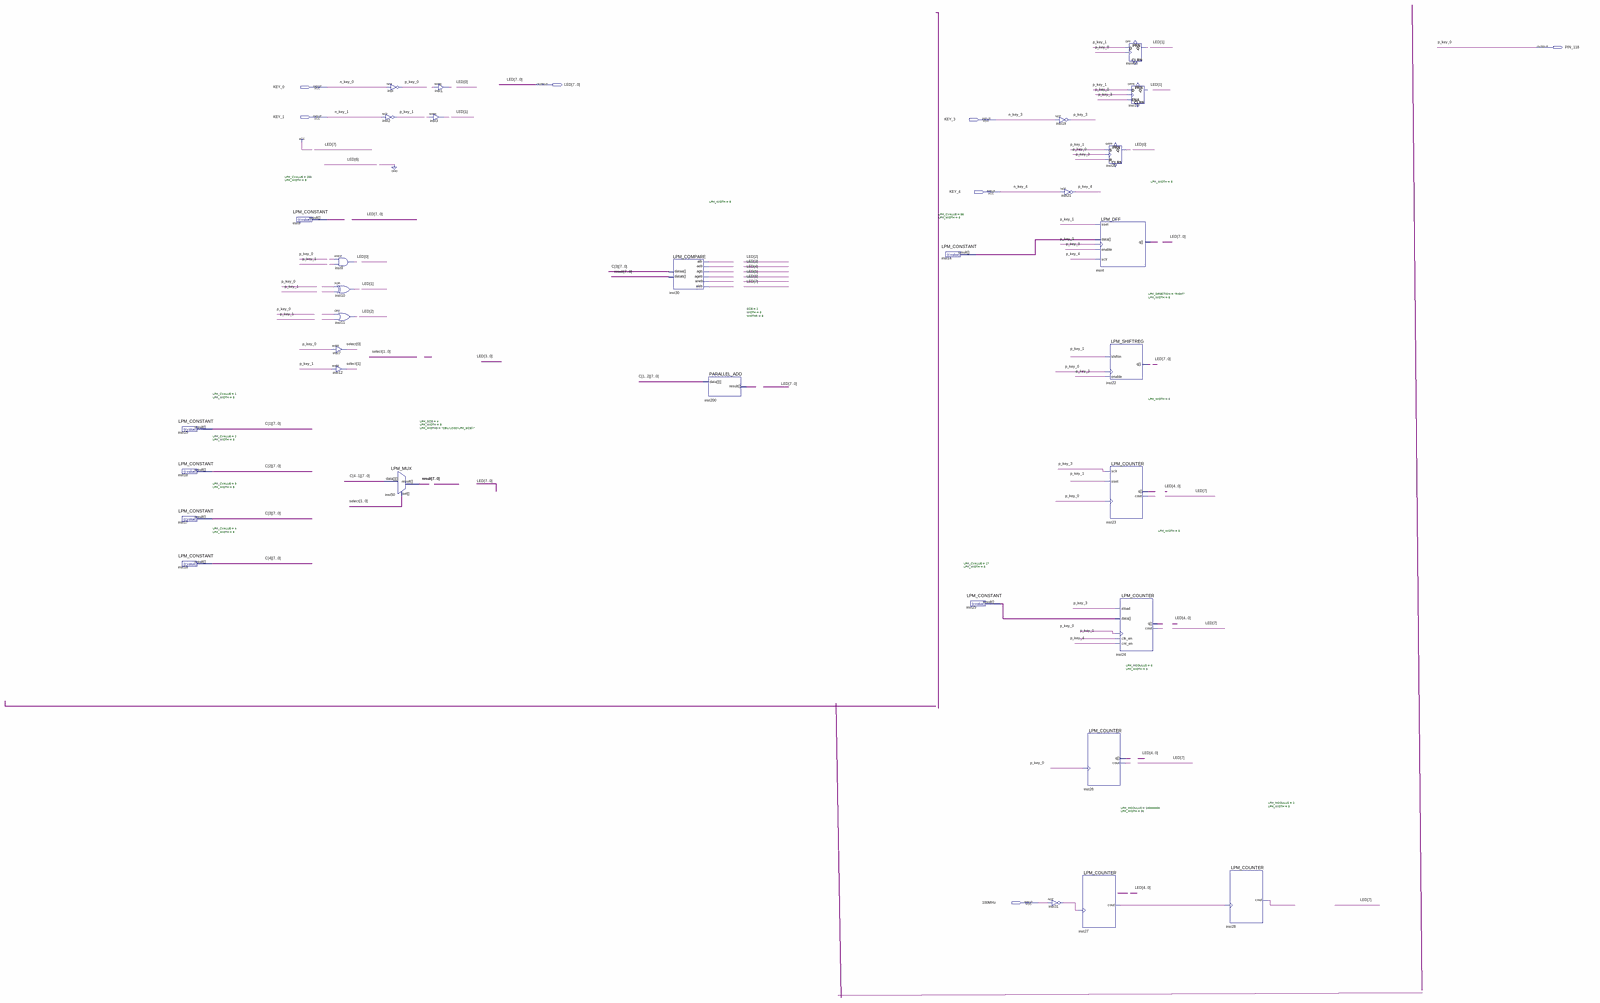
[diagram p0: schematic sheet, whole]
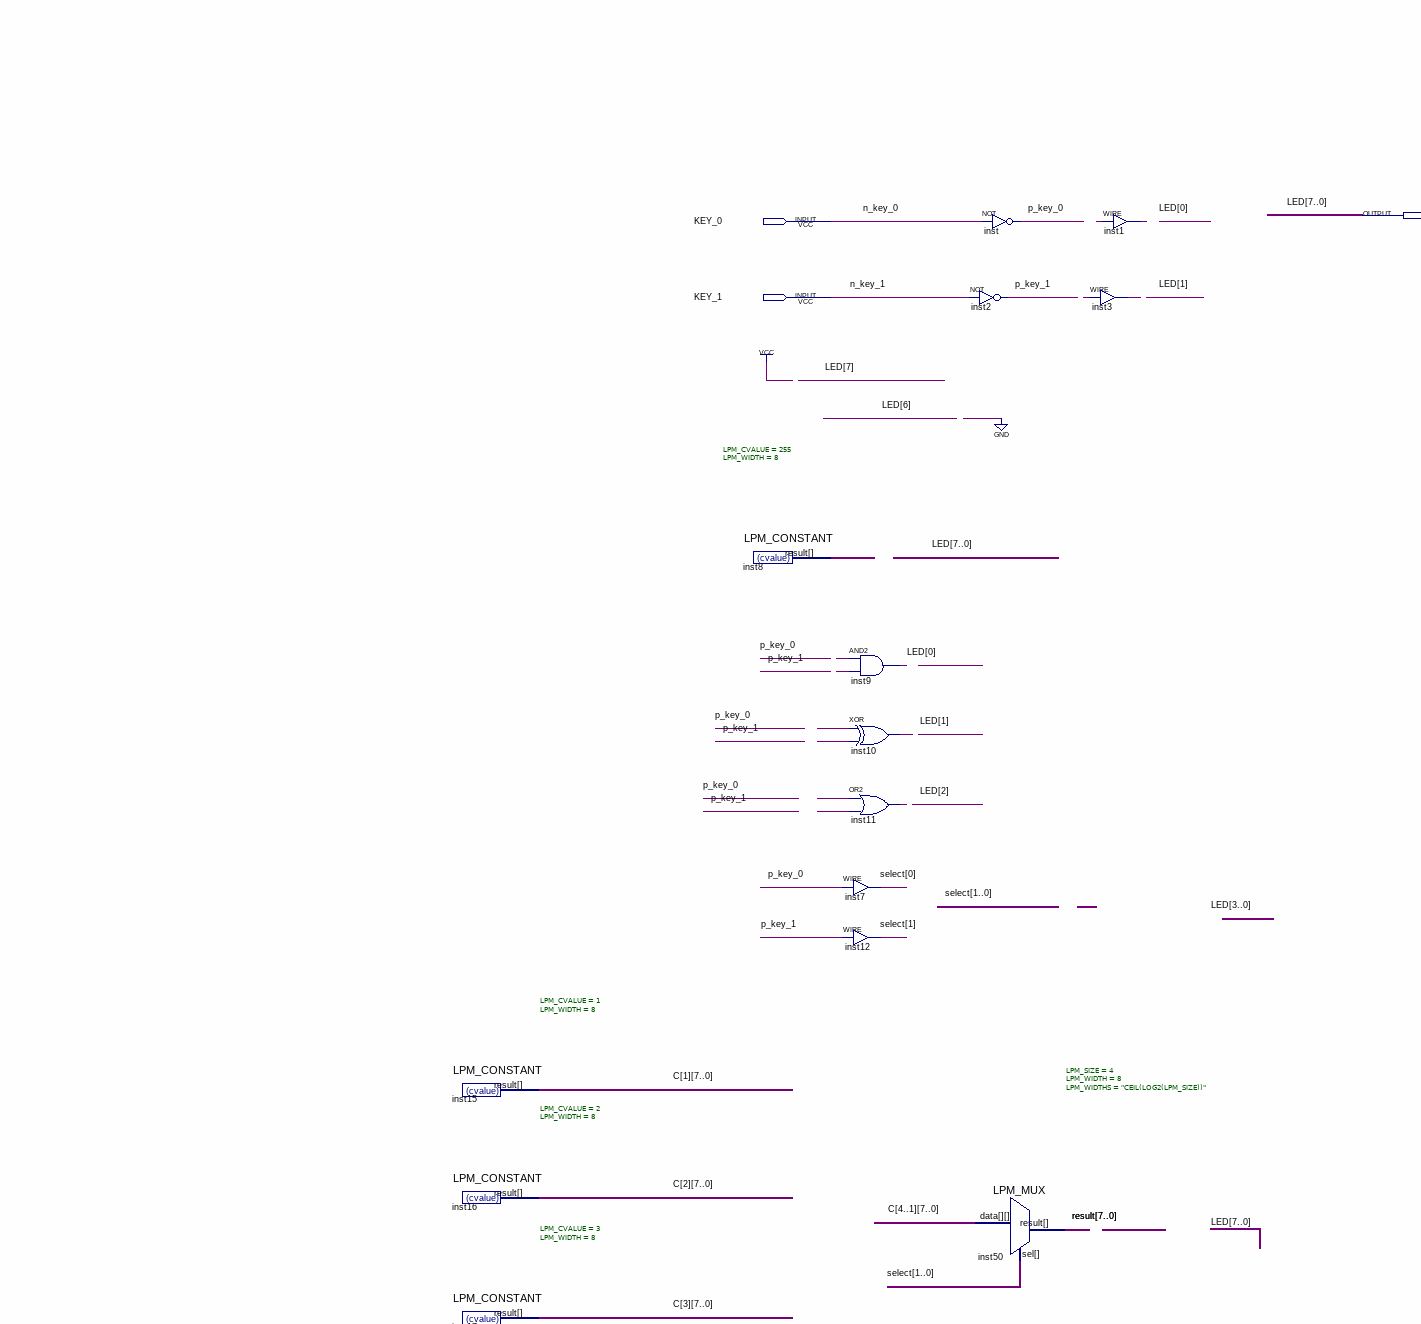
[diagram p1: schematic sheet, upper left part]
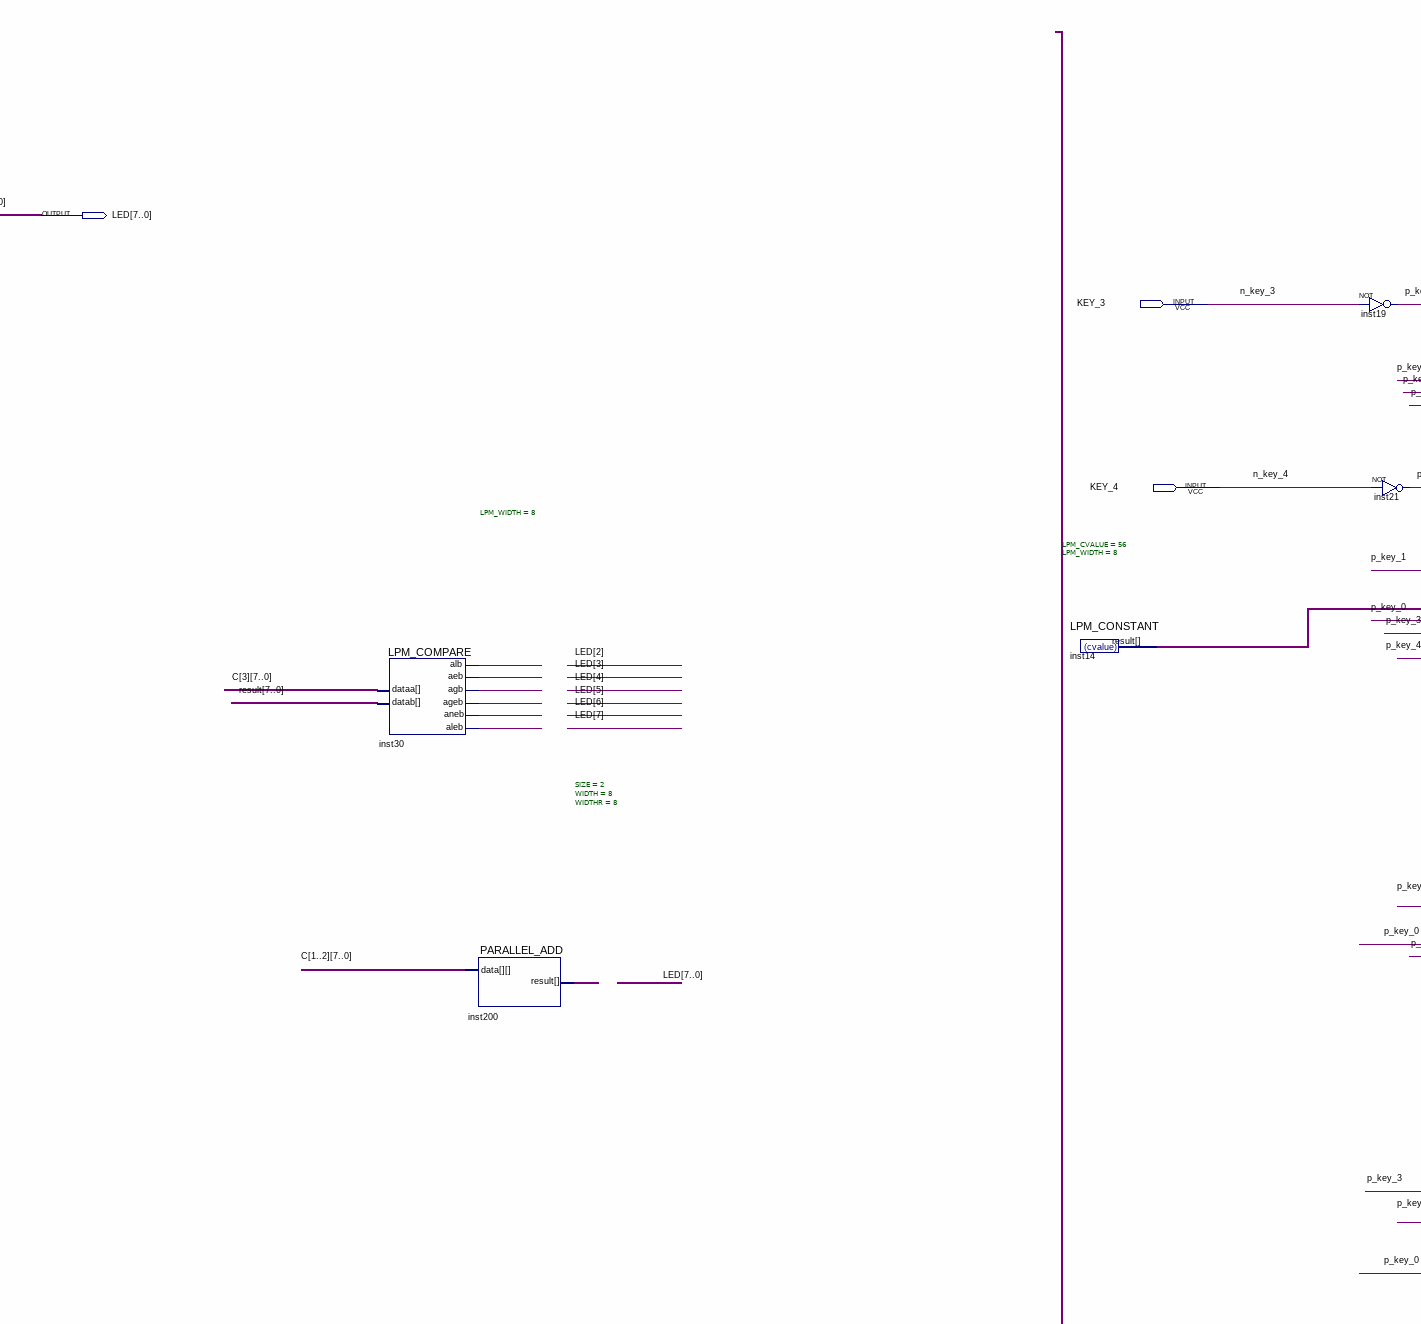
[diagram p2: schematic sheet, upper centre part]
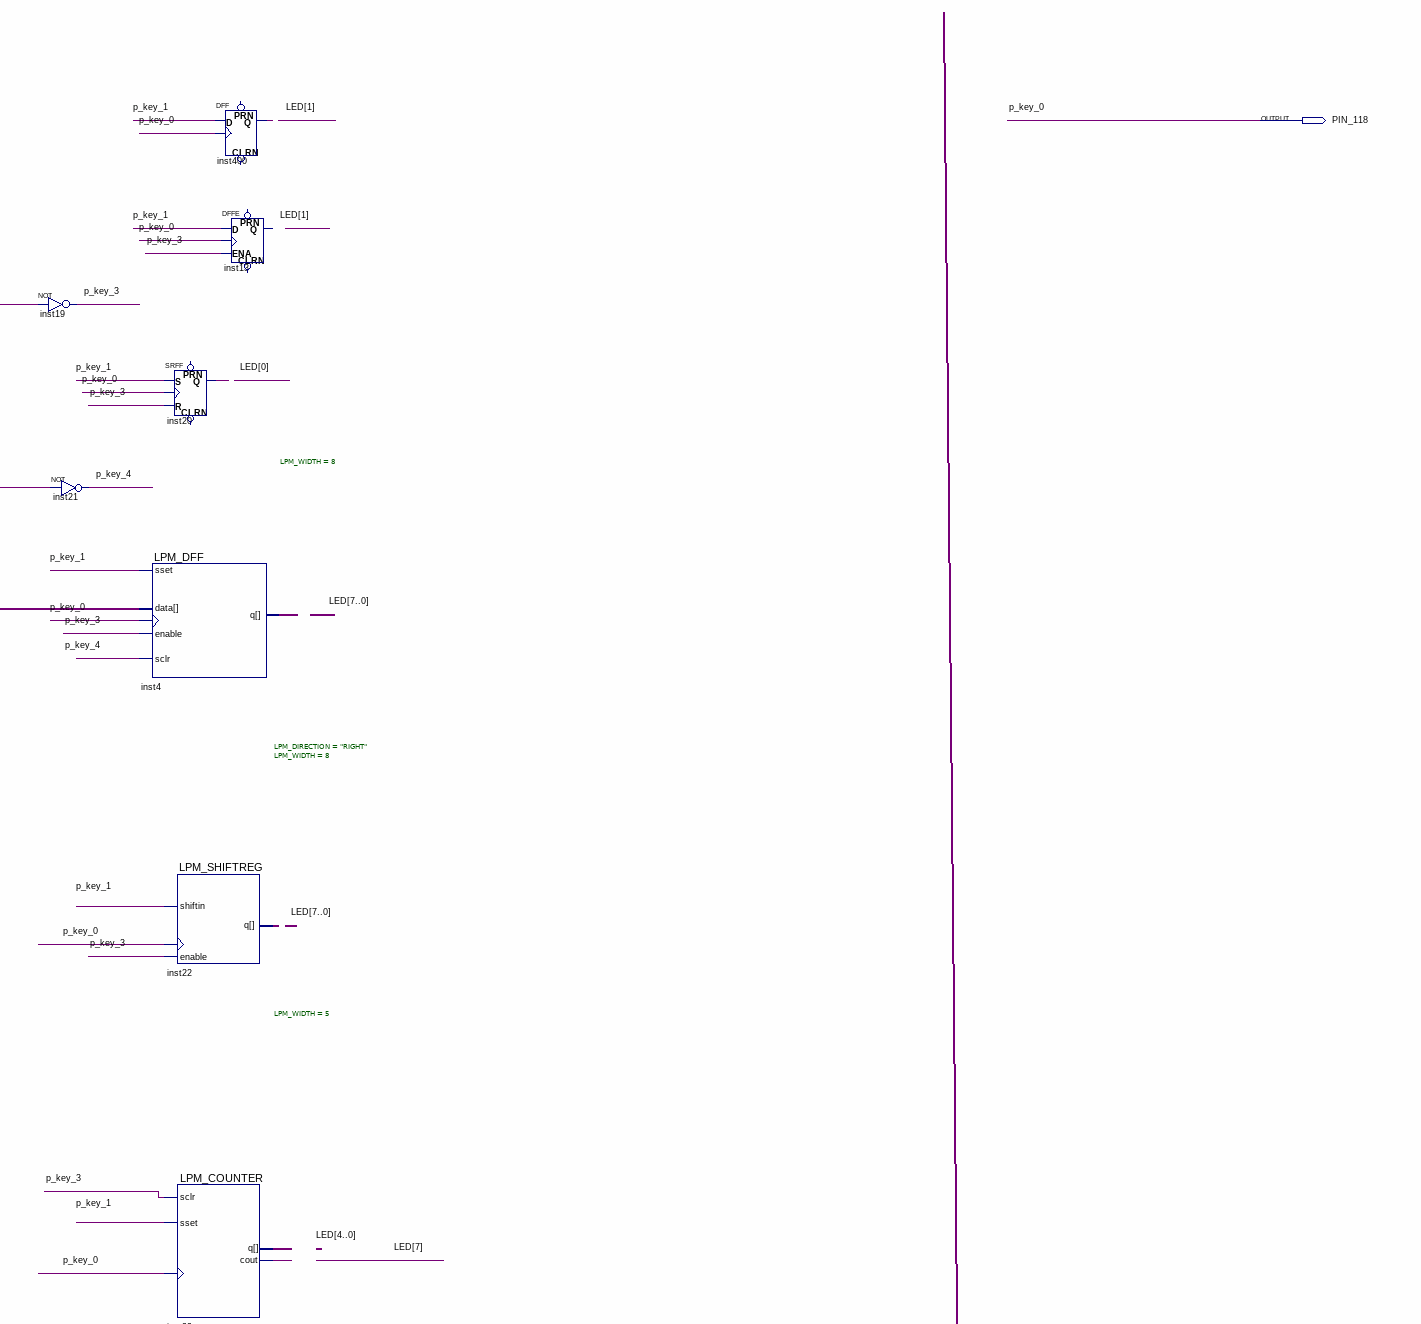
[diagram p3: schematic sheet, upper right part]
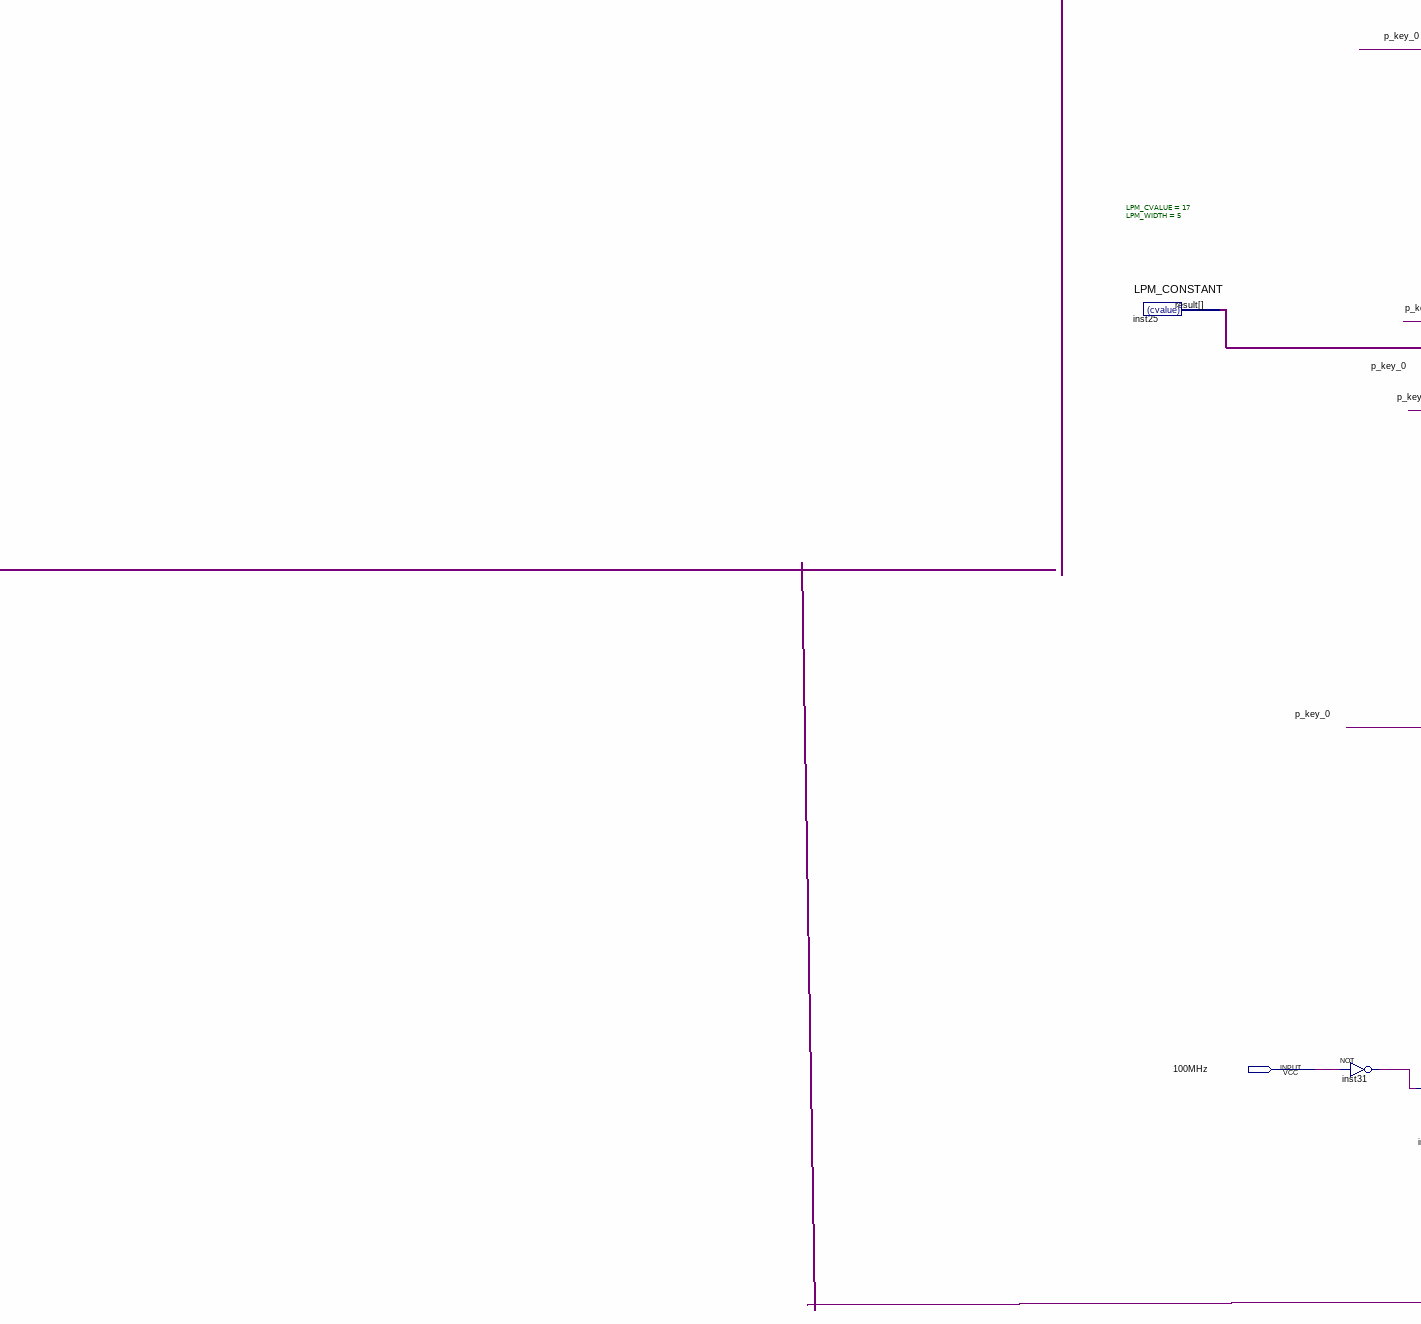
[diagram p4: schematic sheet, lower centre part]
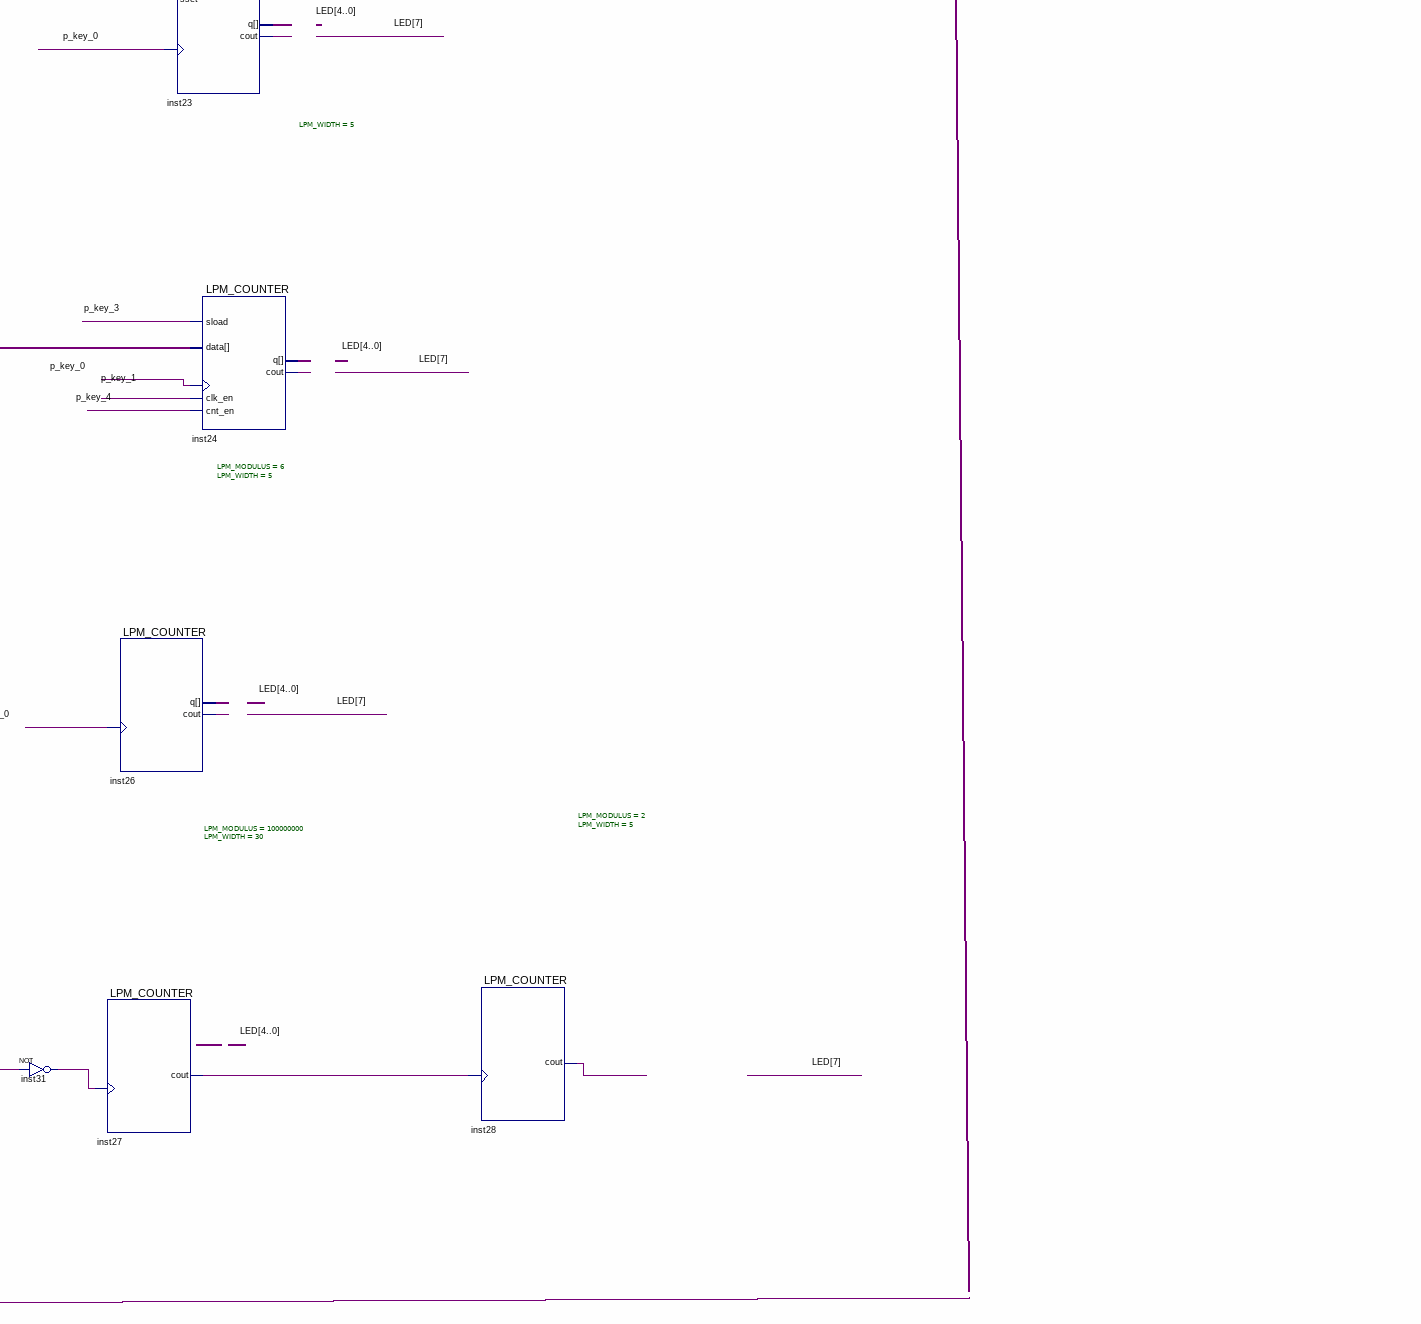
[diagram p5: schematic sheet, lower right part]
// Quartus schematic lesson_horizont_1.bdf as structural Verilog: 32 symbols, 7 pins
module lesson_horizont_1 (
  input  KEY_0,
  input  KEY_1,
  input  KEY_3,
  input  KEY_4,
  input  \100MHz ,
  output PIN_118,
  output [7:0] LED
);

  wire inst1_out, inst3_out, inst9_out, inst10_out, inst11_out, inst20_q, inst23_cout, inst24_cout,
       inst26_cout, inst27_cout, inst28_cout, inst30_aeb, inst30_agb, inst30_ageb, inst30_alb, inst30_aleb,
       inst30_aneb, inst31_out, inst400_q, p_key_1, p_key_3, p_key_4, undriven, undriven_2, undriven_3,
       undriven_4, undriven_5, undriven_6, undriven_7, undriven_8;
  wire [1:0] select;
  wire [4:0] inst23_q, inst24_q, inst25_result, inst26_q;
  wire [7:0] C_1, C_2, C_3, C_4, inst4_q, inst8_result, inst14_result, inst22_q, inst200_result, result;

  LPM_CONSTANT #(.LPM_CVALUE(1), .LPM_WIDTH(8)) inst15 (.result(C_1));
  LPM_CONSTANT #(.LPM_CVALUE(2), .LPM_WIDTH(8)) inst16 (.result(C_2));
  LPM_CONSTANT #(.LPM_CVALUE(3), .LPM_WIDTH(8)) inst17 (.result(C_3));
  LPM_CONSTANT #(.LPM_CVALUE(4), .LPM_WIDTH(8)) inst18 (.result(C_4));
  LPM_CONSTANT #(.LPM_CVALUE(255), .LPM_WIDTH(8)) inst8 (.result(inst8_result));
  and inst9 (inst9_out, undriven_3, undriven_4);
  xor inst10 (inst10_out, undriven_5, undriven_6);
  or inst11 (inst11_out, undriven_7, undriven_8);
  assign select[0] = PIN_118;  // WIRE inst7
  assign select[1] = p_key_1;  // WIRE inst12
  not inst (PIN_118, KEY_0);
  not inst2 (p_key_1, KEY_1);
  LPM_MUX #(.LPM_SIZE(4), .LPM_WIDTH(8), .LPM_WIDTHS("CEIL(LOG2(LPM_SIZE))")) inst50 (
    .data({C_4, C_3, C_2, C_1}), .sel(select), .result(result));
  assign inst1_out = undriven;  // WIRE inst1
  assign inst3_out = undriven_2;  // WIRE inst3
  LPM_COMPARE #(.LPM_WIDTH(8)) inst30 (
    .dataa(C_3), .datab(result), .aeb(inst30_aeb), .agb(inst30_agb), .ageb(inst30_ageb), .alb(inst30_alb),
    .aleb(inst30_aleb), .aneb(inst30_aneb));
  PARALLEL_ADD #(.SIZE(2), .WIDTH(8), .WIDTHR(8)) inst200 (.data({C_1, C_2}), .result(inst200_result));
  LPM_CONSTANT #(.LPM_CVALUE(56), .LPM_WIDTH(8)) inst14 (.result(inst14_result));
  LPM_CONSTANT #(.LPM_CVALUE(17), .LPM_WIDTH(5)) inst25 (.result(inst25_result));
  not inst19 (p_key_3, KEY_3);
  not inst31 (inst31_out, \100MHz );
  not inst21 (p_key_4, KEY_4);
  LPM_DFF #(.LPM_WIDTH(8)) inst4 (
    .clock(PIN_118), .data(inst14_result), .enable(p_key_3), .sclr(p_key_4), .sset(p_key_1), .q(inst4_q));
  LPM_COUNTER #(.LPM_MODULUS(6), .LPM_WIDTH(5)) inst26 (.clock(PIN_118), .cout(inst26_cout), .q(inst26_q));
  LPM_COUNTER #(.LPM_MODULUS(100000000), .LPM_WIDTH(30)) inst27 (.clock(inst31_out), .cout(inst27_cout));
  SRFF inst20 (.S(p_key_1), .R(p_key_3), .CLK(PIN_118), .Q(inst20_q));  // open: PRN, CLRN
  LPM_SHIFTREG #(.LPM_DIRECTION("RIGHT"), .LPM_WIDTH(8)) inst22 (
    .clock(PIN_118), .enable(p_key_3), .shiftin(p_key_1), .q(inst22_q));
  LPM_COUNTER #(.LPM_WIDTH(5)) inst23 (
    .clock(PIN_118), .sclr(p_key_3), .sset(p_key_1), .cout(inst23_cout), .q(inst23_q));
  LPM_COUNTER #(.LPM_WIDTH(5)) inst24 (
    .clk_en(p_key_1), .clock(PIN_118), .cnt_en(p_key_4), .data(inst25_result), .sload(p_key_3),
    .cout(inst24_cout), .q(inst24_q));
  DFF inst400 (.CLK(PIN_118), .D(p_key_1), .Q(inst400_q));  // open: CLRN, PRN
  DFFE inst13 (.D(p_key_1), .CLK(PIN_118), .ENA(p_key_3));  // open: PRN, CLRN, Q
  LPM_COUNTER #(.LPM_MODULUS(2), .LPM_WIDTH(5)) inst28 (.clock(inst27_cout), .cout(inst28_cout));

  // Other names for the same wires on the sheet: n_key_0 = KEY_0; n_key_1 = KEY_1; n_key_3 = KEY_3; n_key_4 = KEY_4;
  //   p_key_0 = PIN_118
endmodule
